# Altium schematic sheet GENERAL-IO.SchDoc
size A3
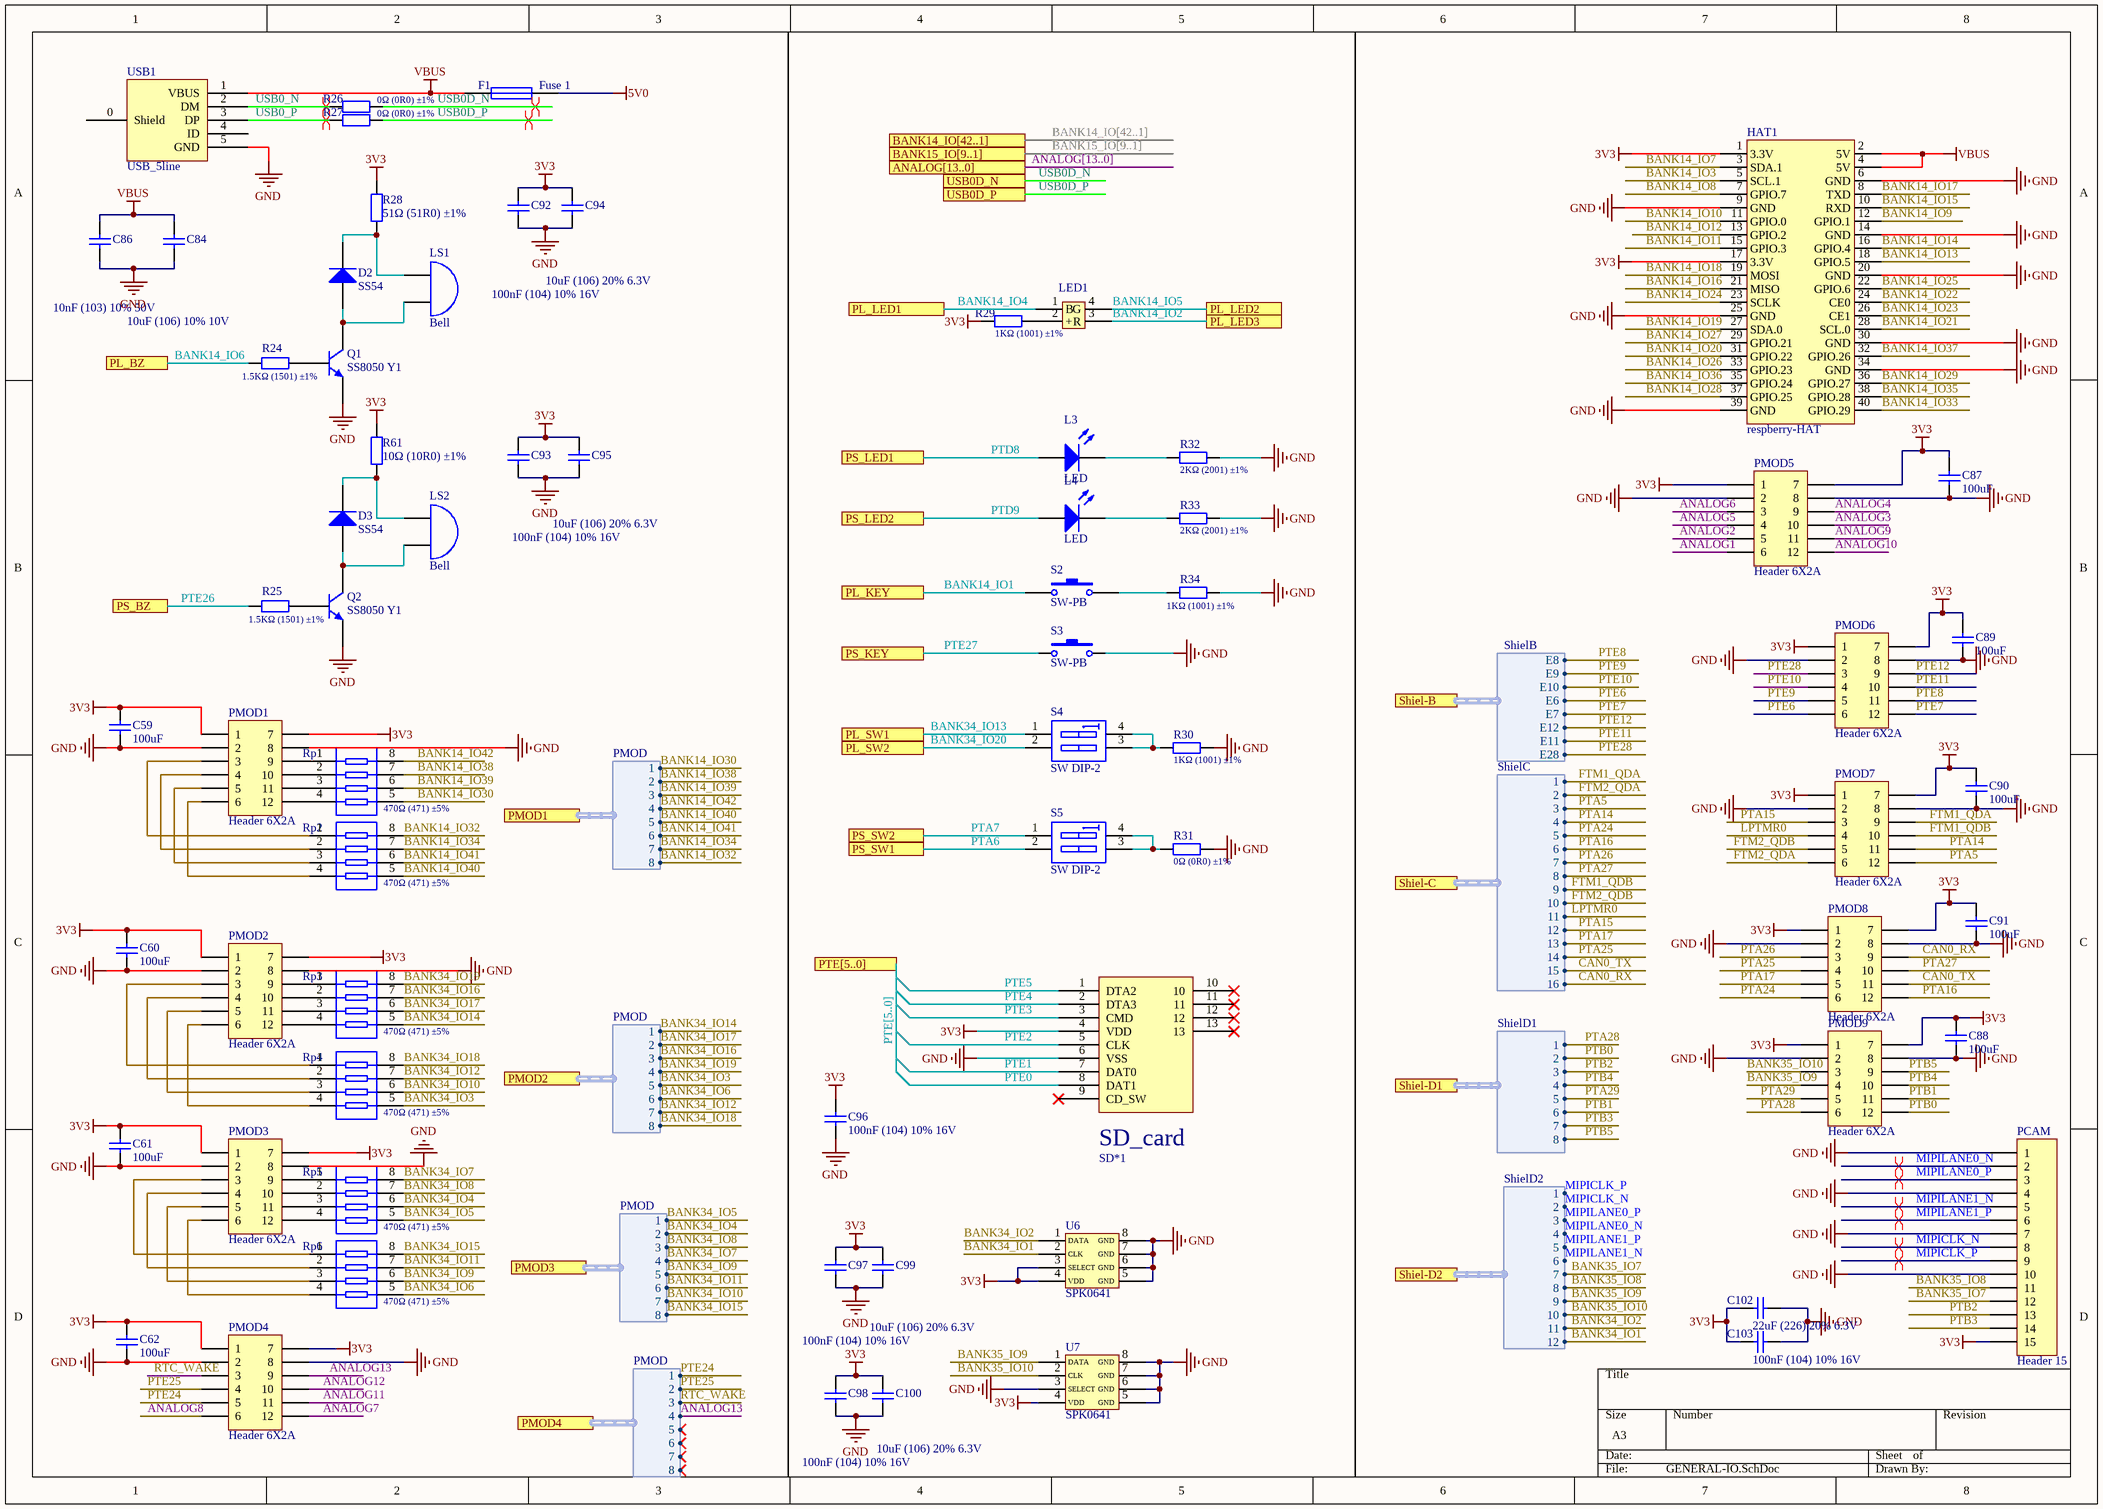
[diagram p0: GENERAL-IO.SchDoc]

## Parts
C59  value 100uF  [LC-1206]  (hidden comment: Cap)
C60  value 100uF  [LC-1206]  (hidden comment: Cap)
C61  value 100uF  [LC-1206]  (hidden comment: Cap)
C62  value 100uF  [LC-1206]  (hidden comment: Cap)
C84  10uF (106) 10% 10V  [0603_C]
C86  10nF (103) 10% 50V  [0402_C]
C87  value 100uF  [LC-1206]  (hidden comment: Cap)
C88  value 100uF  [LC-1206]  (hidden comment: Cap)
C89  value 100uF  [LC-1206]  (hidden comment: Cap)
C90  value 100uF  [LC-1206]  (hidden comment: Cap)
C91  value 100uF  [LC-1206]  (hidden comment: Cap)
C92  100nF (104) 10% 16V  [0402_C]
C93  100nF (104) 10% 16V  [0402_C]
C94  10uF (106) 20% 6.3V  [0402_C]
C95  10uF (106) 20% 6.3V  [0402_C]
C96  100nF (104) 10% 16V  [0402_C]
C97  100nF (104) 10% 16V  [0402_C]
C98  100nF (104) 10% 16V  [0402_C]
C99  10uF (106) 20% 6.3V  [0402_C]
C100  10uF (106) 20% 6.3V  [0402_C]
C102  22uF (226) 20% 6.3V  [0603_C]
C103  100nF (104) 10% 16V  [0402_C]
D2  SS54  [SMA(DO-214AC)_S1]
D3  SS54  [SMA(DO-214AC)_S1]
F1  Fuse 1  [1206]
HAT1  respberry-HAT  [RESPBERRY-HAT]
L3  LED  [1608[0603]]
L4  LED  [1608[0603]]
LED1  RGB_LED1206  [RGB]  (value not drawn)
LS1  Bell  [MLT-5020 BZ]
LS2  Bell  [BZ]
PCAM  Header 15  [MHDR1X15]
PMOD1  Header 6X2A  [SMT-HEADER 6*2]
PMOD2  Header 6X2A  [SMT-HEADER 6*2]
PMOD3  Header 6X2A  [SMT-HEADER 6*2]
PMOD4  Header 6X2A  [SMT-HEADER 6*2]
PMOD5  Header 6X2A  [SMT-HEADER 6*2]
PMOD6  Header 6X2A  [SMT-HEADER 6*2]
PMOD7  Header 6X2A  [SMT-HEADER 6*2]
PMOD8  Header 6X2A  [SMT-HEADER 6*2]
PMOD9  Header 6X2A  [SMT-HEADER 6*2]
Q1  SS8050 Y1  [SOT-23(SOT-23-3)]
Q2  SS8050 Y1  [SOT-23(SOT-23-3)]
R24  1.5KΩ (1501) ±1%  [0402_R]
R25  1.5KΩ (1501) ±1%  [0402_R]
R26  0Ω (0R0) ±1%  [0402_R]
R27  0Ω (0R0) ±1%  [0402_R]
R28  51Ω (51R0) ±1%  [0402_R]
R29  1KΩ (1001) ±1%  [0402_R]
R30  1KΩ (1001) ±1%  [0402_R]
R31  0Ω (0R0) ±1%  [0402_R]
R32  2KΩ (2001) ±1%  [0402_R]
R33  2KΩ (2001) ±1%  [0402_R]
R34  1KΩ (1001) ±1%  [0402_R]
R61  10Ω (10R0) ±1%  [0402_R]
Rp1  470Ω (471) ±5%  [0603_Rx4]
Rp2  470Ω (471) ±5%  [0603_Rx4]
Rp3  470Ω (471) ±5%  [0603_Rx4]
Rp4  470Ω (471) ±5%  [0603_Rx4]
Rp5  470Ω (471) ±5%  [0603_Rx4]
Rp6  470Ω (471) ±5%  [0603_Rx4]
S2  SW-PB  [key 3*4*2]
S3  SW-PB  [key 3*4*2]
S4  SW DIP-2  [sw*2]
S5  SW DIP-2  [sw*2]
SD*1  TF_card  [TF卡座(短体)]  (value not drawn)
U6  SPK0641  [SPK0641HT]
U7  SPK0641  [SPK0641HT]
USB1  USB_5line  [USB-MICRO-5P-2F]

## Ports
ANALOG[13..0] (harness Flexbus), BANK14_IO[42..1], BANK15_IO[9..1], PL_BZ, PL_KEY, PL_LED1, PL_LED2, PL_LED3, PL_SW1, PL_SW2, PMOD1 (harness PMOD), PMOD2 (harness PMOD), PMOD3 (harness PMOD), PMOD4 (harness PMOD), PS_BZ, PS_KEY, PS_LED1, PS_LED2, PS_SW1, PS_SW2, PTE[5..0], Shiel-B (harness ShielB), Shiel-C (harness ShielC), Shiel-D1 (harness ShielD1), Shiel-D2 (harness ShielD2), USB0D_N, USB0D_P

## Harnesses
ShielB: E8, E9, E10, E6, E7, E12, E11, E28
PMOD: 1, 2, 3, 4, 5, 6, 7, 8
ShielC: 1, 2, 3, 4, 5, 6, 7, 8, 9, 10, 11, 12, 13, 14, 15, 16
ShielD1: 1, 2, 3, 4, 5, 6, 7, 8
ShielD2: 1, 2, 3, 4, 5, 6, 7, 8, 9, 10, 11, 12

## Nets
3V3: C59.2 C60.2 C61.2 C62.2 C87.2 C88.2 C89.2 C90.2 C91.2 C92.2 C93.2 C94.2 C95.2 C96.2 C97.2 C98.2 C99.2 C100.2 C102.1 C103.1 HAT1.1(3.3V) HAT1.17(3.3V) PCAM.15 PMOD1.1 PMOD1.7 PMOD2.1 PMOD2.7 PMOD3.1 PMOD3.7 PMOD4.1 PMOD4.7 PMOD5.1 PMOD5.7 PMOD6.1 PMOD6.7 PMOD7.1 PMOD7.7 PMOD8.1 PMOD8.7 PMOD9.1 PMOD9.7 R28.2 R29.1 R61.2 SD*1.4(VDD) U6.3(SELECT) U6.4(VDD) U7.4(VDD)
5V0: F1.1
GND: C59.1 C60.1 C61.1 C62.1 C84.1 C86.1 C87.1 C88.1 C89.1 C90.1 C91.1 C92.1 C93.1 C94.1 C95.1 C96.1 C97.1 C98.1 C99.1 C100.1 C102.2 C103.2 HAT1.6(GND) HAT1.9(GND) HAT1.14(GND) HAT1.20(GND) HAT1.25(GND) HAT1.30(GND) HAT1.34(GND) HAT1.39(GND) PCAM.1 PCAM.4 PCAM.7 PCAM.10 PMOD1.2 PMOD1.8 PMOD2.2 PMOD2.8 PMOD3.2 PMOD3.8 PMOD4.2 PMOD4.8 PMOD5.2 PMOD5.8 PMOD6.2 PMOD6.8 PMOD7.2 PMOD7.8 PMOD8.2 PMOD8.8 PMOD9.2 PMOD9.8 Q1.2(E) Q2.2(E) R30.2 R31.2 R32.2 R33.2 R34.2 S3.2 SD*1.6(VSS) U6.5(GND) U6.6(GND) U6.7(GND) U6.8(GND) U7.3(SELECT) U7.5(GND) U7.6(GND) U7.7(GND) U7.8(GND) USB1.5(GND)
VBUS: C84.2 C86.2 F1.2 HAT1.2(5V) HAT1.4(5V) USB1.1(VBUS)
ANALOG1: PMOD5.6
ANALOG2: PMOD5.5
ANALOG3: PMOD5.10
ANALOG4: PMOD5.9
ANALOG5: PMOD5.4
ANALOG6: PMOD5.3
ANALOG7: PMOD4.12
ANALOG8: PMOD4.6
ANALOG9: PMOD5.11
ANALOG10: PMOD5.12
ANALOG11: PMOD4.11
ANALOG12: PMOD4.10
ANALOG13: PMOD4.9 ; port PMOD4.4
BANK14_IO1: S2.1 ; port PL_KEY
BANK14_IO2: LED1.3(R) ; port PL_LED3
BANK14_IO3: HAT1.5(SCL.1)
BANK14_IO4: LED1.1(B) ; port PL_LED1
BANK14_IO5: LED1.4(G) ; port PL_LED2
BANK14_IO6: R24.1 ; port PL_BZ
BANK14_IO7: HAT1.3(SDA.1)
BANK14_IO8: HAT1.7(GPIO.7)
BANK14_IO9: HAT1.12(GPIO.1)
BANK14_IO10: HAT1.11(GPIO.0)
BANK14_IO11: HAT1.15(GPIO.3)
BANK14_IO12: HAT1.13(GPIO.2)
BANK14_IO13: HAT1.18(GPIO.5)
BANK14_IO14: HAT1.16(GPIO.4)
BANK14_IO15: HAT1.10(RXD)
BANK14_IO16: HAT1.21(MISO)
BANK14_IO17: HAT1.8(TXD)
BANK14_IO18: HAT1.19(MOSI)
BANK14_IO19: HAT1.27(SDA.0)
BANK14_IO20: HAT1.31(GPIO.22)
BANK14_IO21: HAT1.28(SCL.0)
BANK14_IO22: HAT1.24(CE0)
BANK14_IO23: HAT1.26(CE1)
BANK14_IO24: HAT1.23(SCLK)
BANK14_IO25: HAT1.22(GPIO.6)
BANK14_IO26: HAT1.33(GPIO.23)
BANK14_IO27: HAT1.29(GPIO.21)
BANK14_IO28: HAT1.37(GPIO.25)
BANK14_IO29: HAT1.36(GPIO.27)
BANK14_IO30: Rp1.5 ; port PMOD1.1
BANK14_IO32: Rp2.8 ; port PMOD1.8
BANK14_IO33: HAT1.40(GPIO.29)
BANK14_IO34: Rp2.7 ; port PMOD1.7
BANK14_IO35: HAT1.38(GPIO.28)
BANK14_IO36: HAT1.35(GPIO.24)
BANK14_IO37: HAT1.32(GPIO.26)
BANK14_IO38: Rp1.7 ; port PMOD1.2
BANK14_IO39: Rp1.6 ; port PMOD1.3
BANK14_IO40: Rp2.5 ; port PMOD1.5
BANK14_IO41: Rp2.6 ; port PMOD1.6
BANK14_IO42: Rp1.8 ; port PMOD1.4
BANK34_IO1: U6.2(CLK) ; port Shiel-D2.12
BANK34_IO2: U6.1(DATA) ; port Shiel-D2.11
BANK34_IO3: Rp4.5 ; port PMOD2.5
BANK34_IO4: Rp5.6 ; port PMOD3.2
BANK34_IO5: Rp5.5 ; port PMOD3.1
BANK34_IO6: Rp6.5 ; port PMOD2.6
BANK34_IO7: Rp5.8 ; port PMOD3.4
BANK34_IO8: Rp5.7 ; port PMOD3.3
BANK34_IO9: Rp6.6 ; port PMOD3.5
BANK34_IO10: Rp4.6 ; port PMOD3.7
BANK34_IO11: Rp6.7 ; port PMOD3.6
BANK34_IO12: Rp4.7 ; port PMOD2.7
BANK34_IO13: S4.1(A1) ; port PL_SW1
BANK34_IO14: Rp3.5 ; port PMOD2.1
BANK34_IO15: Rp6.8 ; port PMOD3.8
BANK34_IO16: Rp3.7 ; port PMOD2.3
BANK34_IO17: Rp3.6 ; port PMOD2.2
BANK34_IO18: Rp4.8 ; port PMOD2.8
BANK34_IO19: Rp3.8 ; port PMOD2.4
BANK34_IO20: S4.2(A2) ; port PL_SW2
BANK35_IO7: PCAM.12 ; port Shiel-D2.7
BANK35_IO8: PCAM.11 ; port Shiel-D2.8
BANK35_IO9: PMOD9.4 U7.1(DATA) ; port Shiel-D2.9
BANK35_IO10: PMOD9.3 U7.2(CLK) ; port Shiel-D2.10
CAN0_RX: PMOD8.9 ; port Shiel-C.16
CAN0_TX: PMOD8.11 ; port Shiel-C.15
FTM1_QDA: PMOD7.9 ; port Shiel-C.1
FTM1_QDB: PMOD7.10 ; port Shiel-C.9
FTM2_QDA: PMOD7.6 ; port Shiel-C.2
FTM2_QDB: PMOD7.5 ; port Shiel-C.10
LPTMR0: PMOD7.4 ; port Shiel-C.11
MIPICLK_N: PCAM.8 ; port Shiel-D2.2
MIPICLK_P: PCAM.9 ; port Shiel-D2.1
MIPILANE0_N: PCAM.2 ; port Shiel-D2.4
MIPILANE0_P: PCAM.3 ; port Shiel-D2.3
MIPILANE1_N: PCAM.5 ; port Shiel-D2.6
MIPILANE1_P: PCAM.6 ; port Shiel-D2.5
PTA5: PMOD7.12 ; port Shiel-C.3
PTA6: S5.2(A2) ; port PS_SW1
PTA7: S5.1(A1) ; port PS_SW2
PTA14: PMOD7.11 ; port Shiel-C.4
PTA15: PMOD7.3 ; port Shiel-C.12
PTA16: PMOD8.12 ; port Shiel-C.6
PTA17: PMOD8.5 ; port Shiel-C.13
PTA24: PMOD8.6 ; port Shiel-C.5
PTA25: PMOD8.4 ; port Shiel-C.14
PTA26: PMOD8.3 ; port Shiel-C.7
PTA27: PMOD8.10 ; port Shiel-C.8
PTA28: PMOD9.6 ; port Shiel-D1.1
PTA29: PMOD9.5 ; port Shiel-D1.5
PTB0: PMOD9.12 ; port Shiel-D1.2
PTB1: PMOD9.11 ; port Shiel-D1.6
PTB2: PCAM.13 ; port Shiel-D1.3
PTB3: PCAM.14 ; port Shiel-D1.7
PTB4: PMOD9.10 ; port Shiel-D1.4
PTB5: PMOD9.9 ; port Shiel-D1.8
PTD8: L3.1(A) ; port PS_LED1
PTD9: L4.1(A) ; port PS_LED2
PTE0: SD*1.8(DAT1)
PTE1: SD*1.7(DAT0)
PTE2: SD*1.5(CLK)
PTE3: SD*1.3(CMD)
PTE4: SD*1.2(DTA3)
PTE5: SD*1.1(DTA2)
PTE6: PMOD6.6 ; port Shiel-B.E6
PTE7: PMOD6.12 ; port Shiel-B.E7
PTE8: PMOD6.11 ; port Shiel-B.E8
PTE9: PMOD6.5 ; port Shiel-B.E9
PTE10: PMOD6.4 ; port Shiel-B.E10
PTE11: PMOD6.10 ; port Shiel-B.E11
PTE12: PMOD6.9 ; port Shiel-B.E12
PTE24: PMOD4.5 ; port PMOD4.1
PTE25: PMOD4.4 ; port PMOD4.2
PTE26: R25.1 ; port PS_BZ
PTE27: S3.1 ; port PS_KEY
PTE28: PMOD6.3 ; port Shiel-B.E28
RTC_WAKE: PMOD4.3 ; port PMOD4.3
USB0_N: R26.1 USB1.2(DM)
USB0_P: R27.1 USB1.3(DP)
USB0D_N: R26.2 ; port USB0D_N
USB0D_P: R27.2 ; port USB0D_P
NetD2_1: D2.1(A) LS1.2(B) Q1.3(C)
NetD2_2: D2.2(K) LS1.1(A) R28.1
NetD3_1: D3.1(A) LS2.2(B) Q2.3(C)
NetD3_2: D3.2(K) LS2.1(A) R61.1
NetL3_2: L3.2(K) R32.1
NetL4_2: L4.2(K) R33.1
NetLED1_2: LED1.2(+) R29.2
NetPMOD1_3: PMOD1.3 Rp2.1
NetPMOD1_4: PMOD1.4 Rp2.2
NetPMOD1_5: PMOD1.5 Rp2.3
NetPMOD1_6: PMOD1.6 Rp2.4
NetPMOD1_9: PMOD1.9 Rp1.1
NetPMOD1_10: PMOD1.10 Rp1.2
NetPMOD1_11: PMOD1.11 Rp1.3
NetPMOD1_12: PMOD1.12 Rp1.4
NetPMOD2_3: PMOD2.3 Rp4.1
NetPMOD2_4: PMOD2.4 Rp4.2
NetPMOD2_5: PMOD2.5 Rp4.3
NetPMOD2_6: PMOD2.6 Rp4.4
NetPMOD2_9: PMOD2.9 Rp3.1
NetPMOD2_10: PMOD2.10 Rp3.2
NetPMOD2_11: PMOD2.11 Rp3.3
NetPMOD2_12: PMOD2.12 Rp3.4
NetPMOD3_3: PMOD3.3 Rp6.1
NetPMOD3_4: PMOD3.4 Rp6.2
NetPMOD3_5: PMOD3.5 Rp6.3
NetPMOD3_6: PMOD3.6 Rp6.4
NetPMOD3_9: PMOD3.9 Rp5.1
NetPMOD3_10: PMOD3.10 Rp5.2
NetPMOD3_11: PMOD3.11 Rp5.3
NetPMOD3_12: PMOD3.12 Rp5.4
NetQ1_1: Q1.1(B) R24.2
NetQ2_1: Q2.1(B) R25.2
NetR30_1: R30.1 S4.3(B2) S4.4(B1)
NetR31_1: R31.1 S5.3(B2) S5.4(B1)
NetR34_1: R34.1 S2.2

Not connected (* = marked no-connect by the designer): SD*1 9(CD_SW)* 10* 11* 12* 13*; USB1 0(Shield) 4(ID)

## Buses and harness runs
bus ANALOG[13..0]
bus BANK14_IO[42..1] = port BANK14_IO[42..1]
bus BANK15_IO[9..1] = port BANK15_IO[9..1]
bus PTE[5..0] = port PTE[5..0]

## Layout directives
differential pair: MIPICLK_N, MIPICLK_P, MIPILANE0_N, MIPILANE0_P, MIPILANE1_N, MIPILANE1_P, USB0_N, USB0_P, USB0D_N, USB0D_P

## Notes on the sheet
- (in symbol TF_card) SD_card

## Library data of the parts
C59-C62 C87-C91 = Cap: 贴片电容; Published: 8-Jun-2000; LatestRevisionDate: 17-Jul-2002; LatestRevisionNote: Re-released for DXP Platform.; PackageReference: RAD-0.3; Publisher: Altium Limited
C84 = 0603 10uF (106) 10% 10V: 贴片电容; ComponentLink1Description: 供应商链接; ComponentLink1URL: http://www.szlcsc.com/product/details_20411.html; Package: 0603; Supplier: LC; SuppliersPartNumber: C19702
C86 = 0402 10nF (103) 10% 50V: 贴片电容; ComponentLink1Description: 供应商链接; ComponentLink1URL: http://www.szlcsc.com/product/details_15869.html; Package: 0402; Supplier: LC; SuppliersPartNumber: C15195
C92 C93 C96-C98 C103 = 0402 100nF (104) 10% 16V: 贴片电容; ComponentLink1Description: 供应商链接; ComponentLink1URL: http://www.szlcsc.com/product/details_1877.html; Package: 0402; Supplier: LC; SuppliersPartNumber: C1525
C94 C95 C99 C100 = 0402 10uF (106) 20% 6.3V: 贴片电容; ComponentLink1Description: 供应商链接; ComponentLink1URL: http://www.szlcsc.com/product/details_16204.html; Package: 0402; Supplier: LC; SuppliersPartNumber: C15525
C102 = 0603 22uF (226) 20% 6.3V: 贴片电容; ComponentLink1Description: 供应商链接; ComponentLink1URL: http://www.szlcsc.com/product/details_60514.html; Package: 0603; Supplier: LC; SuppliersPartNumber: C59461
D2 D3 = SMA(DO-214AC) SS54: 二极管; ComponentLink1Description: 供应商链接; ComponentLink1URL: http://www.szlcsc.com/product/details_23178.html; Package: SMA(DO-214AC); Supplier: LC; SuppliersPartNumber: C22452
F1 = Fuse 1: Fuse; Published: 8-Jun-2000; LatestRevisionDate: 17-Jul-2002; LatestRevisionNote: Re-released for DXP Platform.; PackageReference: PIN-W2/E2.8; Publisher: Altium Limited; PackageDescription: Thru-Hole; 2 Leads
LS1 LS2 = Bell: Electrical Bell; Published: 24-Mar-1999; LatestRevisionDate: 17-Jul-2002; LatestRevisionNote: Re-released for DXP Platform.; PackageReference: PIN2; Publisher: Altium Limited
PCAM = Header 15: Header, 15-Pin; LatestRevisionDate: 17-Jul-2002; LatestRevisionNote: Re-released for DXP Platform.; Publisher: Altium Limited
PMOD1-PMOD9 = Header 6X2A: Header, 6-Pin, Dual row; LatestRevisionDate: 17-Jul-2002; LatestRevisionNote: Re-released for DXP Platform.; Publisher: Altium Limited
Q1 Q2 = SOT-23 SS8050 Y1: 三极管; ComponentLink1Description: 供应商链接; ComponentLink1URL: http://www.szlcsc.com/product/details_2507.html; Package: SOT-23; Supplier: LC; SuppliersPartNumber: C2150
R24 R25 = 0402 1.5KΩ (1501) 1%: 贴片电阻; ComponentLink1Description: 供应商链接; ComponentLink1URL: http://www.szlcsc.com/product/details_26610.html; Package: 0402; Supplier: LC; SuppliersPartNumber: C25867
R26 R27 R31 = 0402 0Ω (0R0) 1%: 贴片电阻; ComponentLink1Description: 供应商链接; ComponentLink1URL: http://www.szlcsc.com/product/details_17853.html; Package: 0402; Supplier: LC; SuppliersPartNumber: C17168
R28 = 0402 51Ω (51R0) 1%: 贴片电阻; ComponentLink1Description: 供应商链接; ComponentLink1URL: http://www.szlcsc.com/product/details_25868.html; Package: 0402; Supplier: LC; SuppliersPartNumber: C25125
R29 R30 R34 = 0402 1KΩ (1001) 1%: 贴片电阻; ComponentLink1Description: 供应商链接; ComponentLink1URL: http://www.szlcsc.com/product/details_12256.html; Package: 0402; Supplier: LC; SuppliersPartNumber: C11702
R32 R33 = 0402 2KΩ (2001) 1%: 贴片电阻; ComponentLink1Description: 供应商链接; ComponentLink1URL: http://www.szlcsc.com/product/details_4516.html; Package: 0402; Supplier: LC; SuppliersPartNumber: C4109
R61 = 0402 10Ω (10R0) 1%: 贴片电阻; ComponentLink1Description: 供应商链接; ComponentLink1URL: http://www.szlcsc.com/product/details_25820.html; Package: 0402; Supplier: LC; SuppliersPartNumber: C25077
Rp1-Rp6 = 0603*4 470Ω (471) 5%: 贴片排阻; ComponentLink1Description: 供应商链接; ComponentLink1URL: http://www.szlcsc.com/product/details_26253.html; Package: 0603*4; Supplier: LC; SuppliersPartNumber: C25510
S2 S3 = SW-PB: Switch
  S2: Published: 24-Mar-1999; LatestRevisionDate: 17-Jul-2002; LatestRevisionNote: Re-released for DXP Platform.; PackageReference: SPST-2; Publisher: Altium Limited; PackageDescription: Switch; 2 Leads
S4 S5 = SW DIP-2: DIP Switch, 2 Position, SPST; Published: 24-Mar-1999; LatestRevisionDate: 17-Jul-2002; LatestRevisionNote: Re-released for DXP Platform.; PackageReference: DIP-4; Publisher: Altium Limited